# EAGLE design project (EAGLE 9.1.3)

## Sheet 1 of 2: Power supply denoising
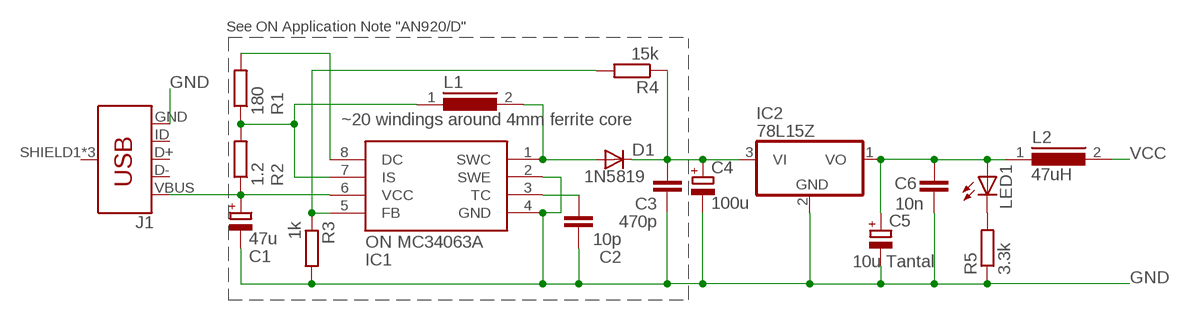
[diagram p0: schematic, sheet 1]

### Parts
C1  47u  CPOL-EUE2.5-5  [E2,5-5]
C2  10p  C-EU050-024X044  [C050-024X044]
C3  470p  C-EU050-024X044  [C050-024X044]
C4  100u  CPOL-EUE2.5-5  [E2,5-5]
C5  10u Tantal  CPOL-EUE2-4  [E2-4]
C6  10n  C-EU050-024X044  [C050-024X044]
D1  1N5819  1N4004  [DO41-10]
IC1  ON MC34063A  MC34063AP  [DIL08]
IC2  78L15Z  [TO92]
J1  USB_MICRO-B_FEMALE-SMT  [USB-B-MICRO-SMD]
L1  ~20 windings around 4mm ferrite core  82114R  [82114R]
L2  47uH  MCC10  [MCC10]
LED1  LED5MM  [LED5MM]
R1  180  R-EU_0207/7  [0207/7]
R2  1.2  R-EU_0207/7  [0207/7]
R3  1k  R-EU_0207/7  [0207/7]
R4  15k  R-EU_0207/7  [0207/7]
R5  3.3k  R-EU_0207/7  [0207/7]

### Nets
GND: C1.- C2.1 C3.1 C4.- C5.- C6.1 IC1.2(SWE) IC1.4(GND) IC2.2(GND) R3.2 R5.1 ; also sheet 2
N$7: IC1.8(DC) R1.2
N$11: D1.A IC1.1(SWC) L1.2
N$22: C5.+ C6.2 IC2.1(VO) L2.1 LED1.A
N$23: C3.2 C4.+ D1.C IC2.3(VI) R4.1
N$25: LED1.K(C) R5.2
N$26: C2.2 IC1.3(TC)
N$28: IC1.5(FB) R3.1 R4.2
N$29: C1.+ IC1.6(VCC) J1.VBUS R2.1
N$30: J1.GND
N$31: IC1.7(IS) L1.1 R1.1 R2.2
VCC: L2.2 ; also sheet 2
Unconnected: J1.D+ J1.D- J1.ID J1.SHIELD1(SHIELD) J1.SHIELD2(SHIELD) J1.SHIELD3(SHIELD)

### Notes on the sheet
- See ON Application Note "AN920/D"

## Sheet 2 of 2: Connectors and op-amp stages
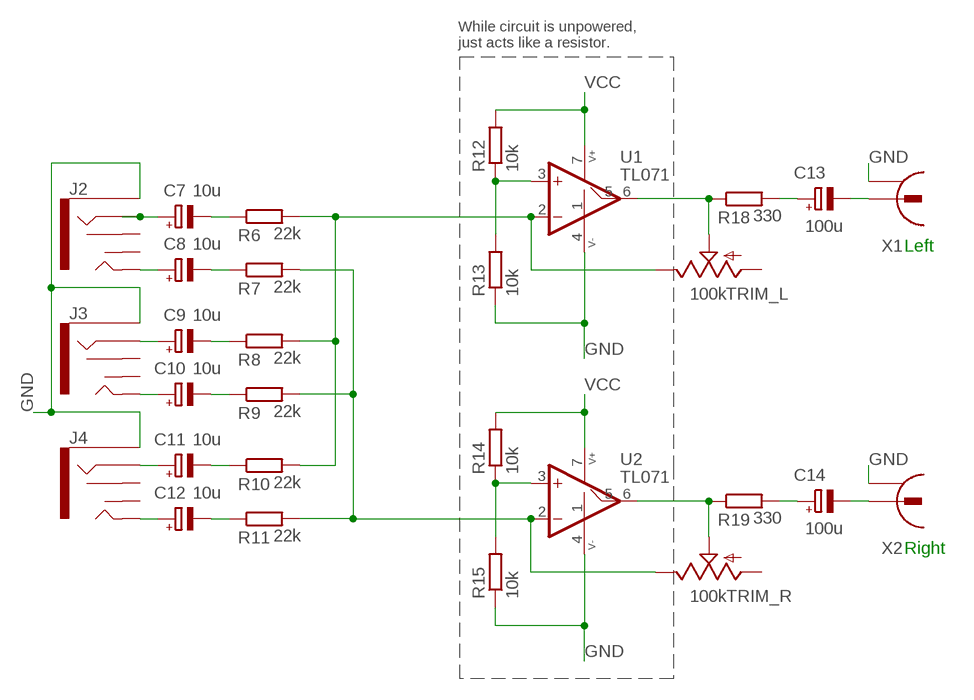
[diagram p1: schematic, sheet 2]

### Parts
C7  10u  CPOL-EUE2-4  [E2-4]
C8  10u  CPOL-EUE2-4  [E2-4]
C9  10u  CPOL-EUE2-4  [E2-4]
C10  10u  CPOL-EUE2-4  [E2-4]
C11  10u  CPOL-EUE2-4  [E2-4]
C12  10u  CPOL-EUE2-4  [E2-4]
C13  100u  CPOL-EUE2-4  [E2-4]
C14  100u  CPOL-EUE2-4  [E2-4]
J2  AUDIO_JACK_3.5MM_KIT  [AUDIO-JACK-KIT]
J3  AUDIO_JACK_3.5MM_KIT  [AUDIO-JACK-KIT]
J4  AUDIO_JACK_3.5MM_KIT  [AUDIO-JACK-KIT]
R6  22k  R-EU_0204/5  [0204/5]
R7  22k  R-EU_0204/5  [0204/5]
R8  22k  R-EU_0204/5  [0204/5]
R9  22k  R-EU_0204/5  [0204/5]
R10  22k  R-EU_0204/5  [0204/5]
R11  22k  R-EU_0204/5  [0204/5]
R12  10k  R-EU_0204/5  [0204/5]
R13  10k  R-EU_0204/5  [0204/5]
R14  10k  R-EU_0204/5  [0204/5]
R15  10k  R-EU_0204/5  [0204/5]
R18  330  R-EU_0204/5  [0204/5]
R19  330  R-EU_0204/5  [0204/5]
TRIM_L  100k  TRIM_US-B25P  [B25P]
TRIM_R  100k  TRIM_US-B25P  [B25P]
U1  TL071  TL081N  [DIL08]
U2  TL071  TL081N  [DIL08]
X1  CONRAD_736880-49  [CINCH]
X2  CONRAD_736880-49  [CINCH]

### Nets
GND: J2.SLEEVE J3.SLEEVE J4.SLEEVE R13.1 R15.1 U1.4(P:V-) U2.4(P:V-) X1.2 X2.2 ; also sheet 1
N$1: C13.- X1.1
N$2: C13.+ R18.2
N$3: C14.- X2.1
N$4: C7.- R6.1
N$5: R18.1 TRIM_L.S U1.6(A:OUT)
N$6: C14.+ R19.2
N$8: C7.+ J2.RING
N$9: R12.1 R13.2 U1.3(A:+IN)
N$10: C8.+ J2.TIP
N$12: R6.2 R8.2 R10.2 TRIM_L.E U1.2(A:-IN)
N$13: C8.- R7.1
N$14: C9.+ J3.RING
N$15: C9.- R8.1
N$16: C10.+ J3.TIP
N$17: C10.- R9.1
N$18: C11.+ J4.RING
N$19: C11.- R10.1
N$20: C12.+ J4.TIP
N$21: C12.- R11.1
N$24: R19.1 TRIM_R.S U2.6(A:OUT)
N$27: R14.1 R15.2 U2.3(A:+IN)
N$33: R7.2 R9.2 R11.2 TRIM_R.E U2.2(A:-IN)
VCC: R12.2 R14.2 U1.7(P:V+) U2.7(P:V+) ; also sheet 1
Unconnected: J2.RSH J2.TSH J3.RSH J3.TSH J4.RSH J4.TSH TRIM_L.A TRIM_R.A U1.1(-NULL:NULL1) U1.5(-NULL:NULL2) U2.1(-NULL:NULL1) U2.5(-NULL:NULL2) X1.2@2 X2.2@2

### Notes on the sheet
- While circuit is unpowered,
  just acts like a resistor.
- Left
- Right

## Library data of the parts
C1 C4 C5 C7-C14 = resistor:CPOL-EU: POLARIZED CAPACITOR, European symbol
C2 C3 C6 = resistor:C-EU: CAPACITOR, European symbol
D1 = diode:1N4004: DIODE general purpose rectifier, 1 A
IC1 = mc34063:MC34063
IC2 = linear:78*: Positive VOLTAGE REGULATOR Source: http://cache.national.com/ds/LM/LM78L05.pdf http://www.fairchildsemi.com/ds/LM/LM7805.pdf
J1 = SparkFun-Connectors:USB_MICRO-B: USB Type Micro-B Connector Male/female and PTH/SMT variants SparkFun Products: SparkFun microB USB Breakout <https://www.sparkfun.com/products/12035> SparkFun USB microB Plug Breakout <https://www.sparkfun.com/products/10031> SparkFun ESP8266 Thing <https://www.sparkfun.com/products/13231>; PROD_ID: CONN-11752
J2-J4 = SparkFun-Connectors:AUDIO_JACK_3.5MM: Audio Jack 3.5mm variants of PTH and SMT stereo audio jack with bypass switches. SparkFun Products: SparkFun SparkPunk Sound Kit <[https://www.sparkfun.com/products/11177]> - PTH MP3 Trigger <https://www.sparkfun.com/products/13720> -3.5mm SMD SparkFun PicoBoard <https://www.sparkfun.com/products/11888>- 2.5mm SMD; PROD_ID: CONN-08774; SF_ID: PRT-08032
L1 = inductors:82114R: INDUCTOR; SPICEPREFIX: L
L2 = inductors:MCC10: INDUCTOR; SPICEPREFIX: L
LED1 = led:LED: LED OSRAM: - CHIPLED LG R971, LG N971, LY N971, LG Q971, LY Q971, LO R971, LY R971 LH N974, LH R974 LS Q976, LO Q976, LY Q976 LO Q996 - Hyper CHIPLED LW Q18S LB Q993, LB Q99A, LB R99A - SideLED LS A670, LO A670, LY A670, LG A670, LP A670 LB A673, LV A673, LT A673, LW A673 LH A674 LY A675 LS A676, LA A676, LO A676, LY A676, LW A676 LS A679, LY A679, LG A679 - Hyper Micro SIDELED® LS Y876, LA Y876, LO Y876, LY Y876 LT Y87S - SmartLED LW L88C, LW L88S LB L89C, LB L89S, LG L890 LS L89K, LO L89K, LY L89K LS L896, LA L896, LO L896, LY L896 - TOPLED LS T670, LO T670, LY T670, LG T670, LP T670 LSG T670, LSP T670, LSY T670, LOP T670, LYG T670 LG T671, LOG T671, LSG T671 LB T673, LV T673, LT T673, LW T673 LH T674 LS T676, LA T676, LO T676, LY T676, LB T676, LH T676, LSB T676, LW T676 LB T67C, LV T67C, LT T67C, LS T67K, LO T67K, LY T67K, LW E67C LS E67B, LA E67B, LO E67B, LY E67B, LB E67C, LV E67C, LT E67C LW T67C LS T679, LY T679, LG T679 LS T770, LO T770, LY T770, LG T770, LP T770 LB T773, LV T773, LT T773, LW T773 LH T774 LS E675, LA E675, LY E675, LS T675 LS T776, LA T776, LO T776, LY T776, LB T776 LHGB T686 LT T68C, LB T68C - Hyper Mini TOPLED® LB M676 - Mini TOPLED Santana® LG M470 LS M47K, LO M47K, LY M47K Source: http://www.osram.convergy.de LUXEON: - LUMILED® LXK2-PW12-R00, LXK2-PW12-S00, LXK2-PW14-U00, LXK2-PW14-V00 LXK2-PM12-R00, LXK2-PM12-S00, LXK2-PM14-U00 LXK2-PE12-Q00, LXK2-PE12-R00, LXK2-PE12-S00, LXK2-PE14-T00, LXK2-PE14-U00 LXK2-PB12-K00, LXK2-PB12-L00, LXK2-PB12-M00, LXK2-PB14-N00, LXK2-PB14-P00, LXK2-PB14-Q00 LXK2-PR12-L00, LXK2-PR12-M00, LXK2-PR14-Q00, LXK2-PR14-R00 LXK2-PD12-Q00, LXK2-PD12-R00, LXK2-PD12-S00 LXK2-PH12-R00, LXK2-PH12-S00 LXK2-PL12-P00, LXK2-PL12-Q00, LXK2-PL12-R00 Source: www.luxeon.com KINGBRIGHT: KA-3528ASYC Source: www.kingbright.com
R1-R15 R18 R19 = resistor:R-EU_: RESISTOR, European symbol
TRIM_L TRIM_R = pot:TRIM_US-: POTENTIOMETER
U1 U2 = op-amp:TL081: JFET OP-AMP
X1 X2 = JRS:CONRAD_736880-49: Cinch Connector ( RCA Jack )

## Board
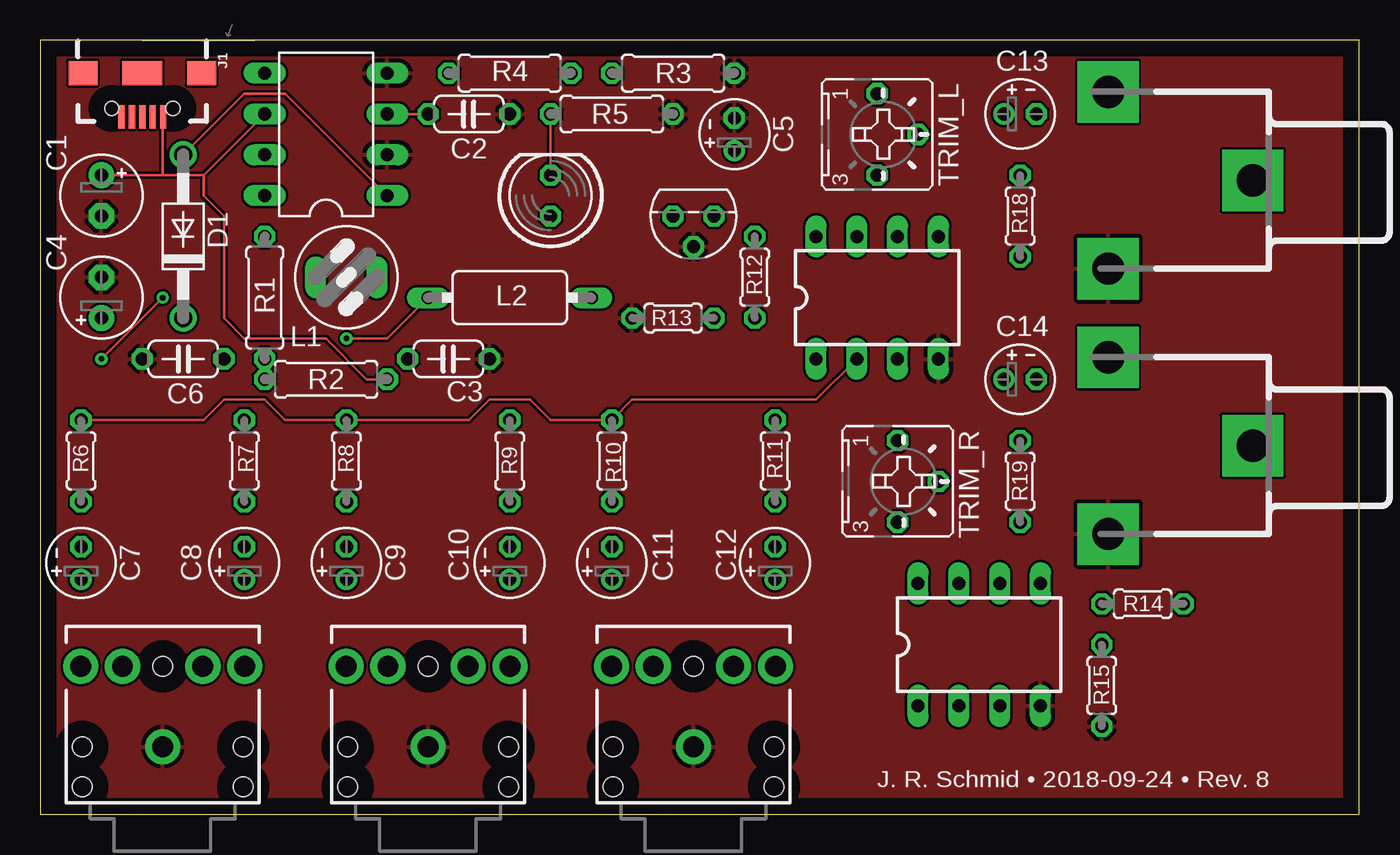
[diagram p2: board, top side]
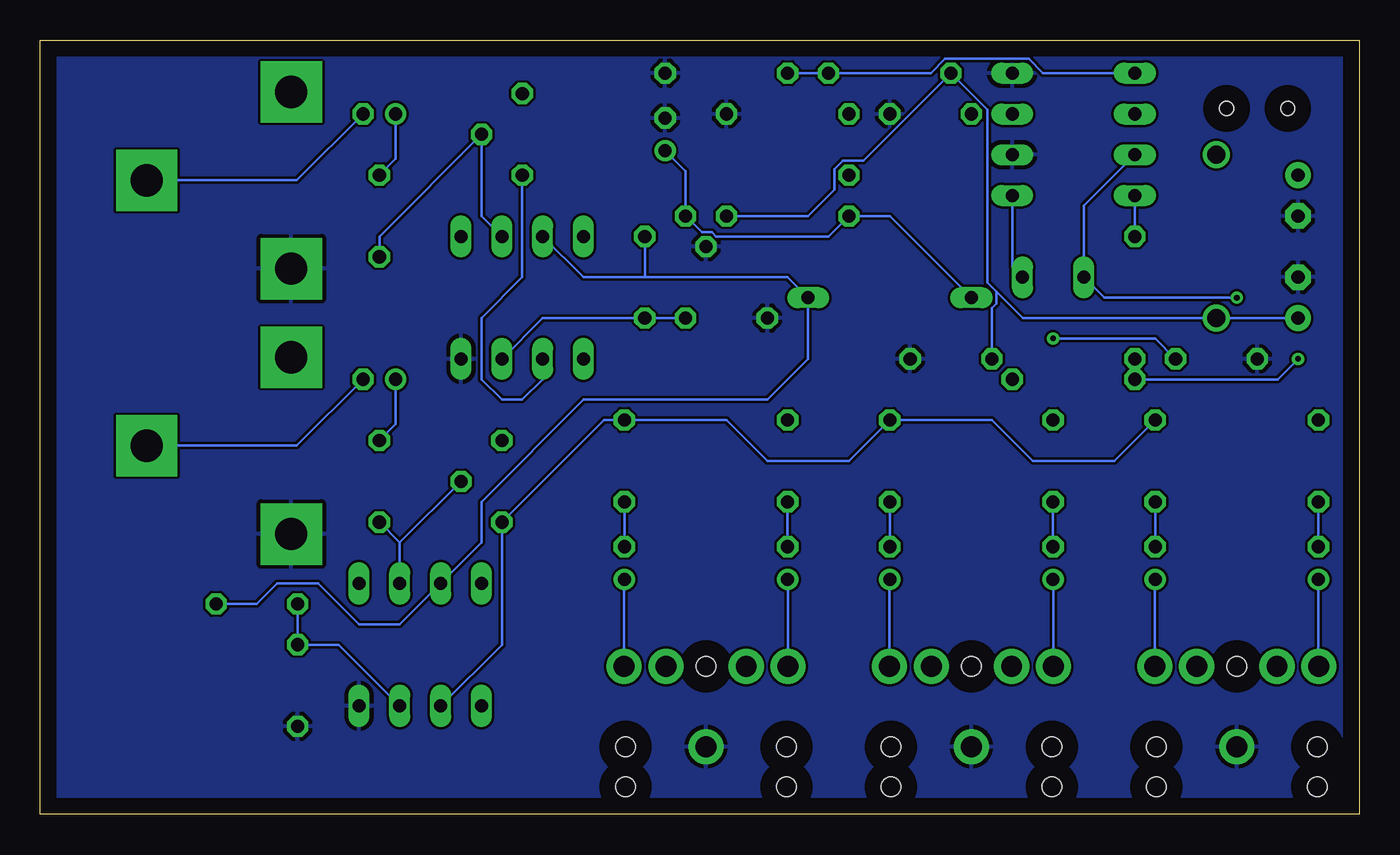
[diagram p3: board, bottom side, seen from below]

Size 82.06 x 48.17 mm. Coordinates in mm from the lower left corner, seen from the top.
Outline: 0,0 82.06,0 82.06,48.17 0,48.17 0,0
Copper layers (1*16): Top 0.035mm / dielectric 1.5mm / Bottom 0.035mm
Design rules "default": minimum track width 6mil, minimum drill 0.35mm, track to track 6mil, track to pad 6mil, pad to pad 6mil, via to via 6mil, smd to smd 6mil, copper to edge 40mil, drill to drill 6mil, minimum pad ring 10mil, minimum via ring 8mil, stop-mask expansion 4mil, vias tented up to drill 0mil, thermal gap 10mil

### Footprints (pad centres in the part's own frame; a part is rotated, then mirrored left to right if it is on the bottom)
E2,5-5 = drill 0.813 pad 1.6: + -1.27,0 | drill 0.813 pad 1.6 octagon: - 1.27,0
C050-024X044 = drill 0.813 octagon: 1 -2.54,0; 2 2.54,0
E2-4 = drill 0.813 pad 1.27: + -1.016,0 | drill 0.813 pad 1.27 octagon: - 1.016,0
DO41-10 = drill 1.118: A 5.08,0; C -5.08,0
DIL08 = drill 0.813 long: 1 -3.81,-3.81; 2 -1.27,-3.81; 3 1.27,-3.81; 4 3.81,-3.81; 5 3.81,3.81; 6 1.27,3.81; 7 -1.27,3.81; 8 -3.81,3.81
TO92 = drill 0.813 octagon: 1 -1.27,0; 2 0,1.905; 3 1.27,0
USB-B-MICRO-SMD = smd 1.45 x 0.4: D+ 2.725,0; D- 2.725,0.65; GND 2.725,-1.3; ID 2.725,-0.65; VBUS 2.725,1.3 | smd 1.5 x 1.8: SHIELD1 0,3.685; SHIELD2 0,-3.685 | smd 1.5 x 2.5: SHIELD3 0,0 | hole 0.85: 2.2,1.9; 2.2,-1.9
AUDIO-JACK-KIT = drill 1.3 pad 2.184: RING 5,5.1; RSH 5,2.5; SLEEVE 0,0; TIP 5,-5.1; TSH 5,-2.5 | hole 1.2: 0,5; -2.5,5; -2.5,-5; 0,-5; 5,0
82114R = drill 0.813 long: 1 0,1.905; 2 0,-1.905
MCC10 = drill 0.813 long: 1 -5.08,0; 2 5.08,0
LED5MM = drill 0.813 octagon: A -1.27,0; K 1.27,0
0207/7 = drill 0.813 octagon: 1 -3.81,0; 2 3.81,0
0204/5 = drill 0.813 octagon: 1 -2.54,0; 2 2.54,0
B25P = drill 0.813 octagon: A -2.54,0; E 2.54,0; S 0,2.54
CINCH = drill 2 pad 3.81 square: 1 -3.92,0; 2 5.08,5.5; 2@2 5.08,-5.5

### Placement (x,y rotation side)
C1  3.81,38.5 270 top
C2  26.67,43.58 180 top
C3  25.4,28.34 180 top
C4  3.81,32.15 90 top
C5  43.18,42.31 90 top
C6  8.89,28.34 0 top
C7  2.54,15.64 90 top
C8  12.7,15.64 90 top
C9  19.05,15.64 90 top
C10  29.21,15.64 90 top
C11  35.56,15.64 90 top
C12  45.72,15.64 90 top
C13  60.96,43.58 0 top
C14  60.96,27.07 0 top
D1  8.89,35.96 90 top
IC1  17.78,42.31 90 top
IC2  40.64,37.23 180 top
J1  6.35,46.12 270 top
J2  7.62,4.21 90 top
J3  24.13,4.21 90 top
J4  40.64,4.21 90 top
L1  19.05,33.42 90 top
L2  29.21,32.15 0 top
LED1  31.75,38.5 90 top
R1  13.97,32.15 90 top
R2  17.78,27.07 180 top
R3  39.37,46.12 0 top
R4  29.21,46.12 0 top
R5  35.56,43.58 180 top
R6  2.54,21.99 90 top
R7  12.7,21.99 90 top
R8  19.05,21.99 90 top
R9  29.21,21.99 90 top
R10  35.56,21.99 90 top
R11  45.72,21.99 90 top
R12  44.45,33.42 90 top
R13  39.37,30.88 0 top
R14  68.58,13.1 0 top
R15  66.04,8.02 90 top
R18  60.96,37.23 90 top
R19  60.96,20.72 90 top
TRIM_L  52.07,42.31 270 top
TRIM_R  53.34,20.72 270 top
U1  52.07,32.15 0 top
U2  58.42,10.56 0 top
X1  71.52,39.45 180 top
X2  71.52,22.94 180 top

### Tracks (layer width: path | path; a pad name or v marks a point on that pad's centre or on a via)
GND
  pour Top: -1.27,49.93 -1.27,-2.14 85.09,-2.14 85.09,51.2 -1.27,51.2
  pour Bottom: -1.27,51.2 -1.27,-2.14 85.09,-2.14 85.09,51.2
N$1
  Bottom 0.152: X1.1 71.12,39.45 66.11,39.45 C13.-
N$2
  Bottom 0.152: C13.+ 59.94,40.79 R18.2
N$3
  Bottom 0.152: X2.1 66.11,22.94 C14.-
N$4
  Bottom 0.152: C7.- R6.1
N$5
  Bottom 0.152: R18.1 60.96,35.96 TRIM_L.S 54.61,37.23 U1.6
N$6
  Bottom 0.152: C14.+ 59.94,24.28 R19.2
N$7
  Bottom 0.152: IC1.8 R1.2
N$8
  Bottom 0.152: J2.RING 2.54,9.23 C7.+
N$9
  Bottom 0.152: U1.3 50.8,30.88 R12.1 R13.2
N$10
  Bottom 0.152: J2.TIP 12.72,14.6 C8.+
N$11
  Top 0.152: D1.A 12.7,44.85 15.24,44.85 IC1.1
  Bottom 0.152: IC1.1 21.59,34.05 L1.2
N$12
  Top 0.152: U1.2 48.26,25.8 36.83,25.8 R10.2 31.75,24.53 30.48,25.8 27.94,25.8 26.67,24.53 R8.2 15.24,24.53 13.97,25.8 11.43,25.8 10.16,24.53 R6.2
  Bottom 0.152: TRIM_L.E 52.07,33.42 54.61,30.88 54.61,27.07 53.34,25.8 52.07,25.8 50.8,27.07 U1.2
N$13
  Bottom 0.152: C8.- R7.1
N$14
  Bottom 0.152: J3.RING 19.03,14.6 C9.+
N$15
  Bottom 0.152: C9.- R8.1
N$16
  Bottom 0.152: J3.TIP 29.23,14.6 C10.+
N$17
  Bottom 0.152: C10.- R9.1
N$18
  Bottom 0.152: J4.RING 35.54,14.6 C11.+
N$19
  Bottom 0.152: C11.- R10.1
N$20
  Bottom 0.152: J4.TIP 45.74,14.6 C12.+
N$21
  Bottom 0.152: C12.- R11.1
N$22  (via drill 0.35)
  Top 0.152: L2.1 21.59,29.61 v19.05,29.61
  Bottom 0.152: C5.+ 41.91,40.02 IC2.1 40.89,36.21 40.27,36.21 40.02,35.96 33.02,35.96 LED1.A 29.21,37.23 L2.1 | v19.05,29.61 12.7,29.61 C6.2
N$23
  Bottom 0.152: 22.58,32.52 22.58,31.78 22.86,31.5 C3.2 | 22.58,32.52 23.14,33.08 23.14,43.86 R4.1 30.86,40.66 32.12,40.66 32.64,40.14 32.64,38.88 34.29,37.23 IC2.3 | C4.+ D1.C 20.94,30.88 22.58,32.52
N$24
  Bottom 0.152: R19.1 59.69,16.91 | 59.69,16.91 U2.6 | TRIM_R.S 59.69,16.91
N$25
  Top 0.152: R5.2 LED1.K
N$26
  Top 0.152: IC1.3 C2.2
N$27
  Bottom 0.152: U2.3 63.5,10.56 R15.2 R14.1
N$28
  Bottom 0.152: R3.1 R4.2 26.66,46.12 25.77,47.01 20.56,47.01 19.67,46.12 IC1.5
N$29
  Top 0.152: IC1.6 10.16,39.77 | 10.16,39.77 7.62,39.77 | 7.62,39.77 C1.+ | J1.VBUS 7.62,43.36 7.62,39.77 | 10.16,39.77 | 10.16,39.77 10.16,38.5 11.43,37.23 11.43,30.88 12.7,29.61 17.78,29.61 20.32,27.07 R2.1
N$31  (via drill 0.35)
  Top 0.152: v7.62,32.15 v3.81,28.34
  Bottom 0.152: IC1.7 17.14,37.87 L1.1 15.88,32.15 v7.62,32.15 | v3.81,28.34 5.08,27.07 R2.2 R1.1
N$33
  Bottom 0.152: U2.2 53.34,10.56 TRIM_R.E 46.99,24.53 R11.2 39.37,24.53 36.83,21.99 31.75,21.99 R9.2 22.86,24.53 20.32,21.99 15.24,21.99 R7.2
VCC
  Bottom 0.152: R14.2 68.58,13.1 67.31,14.37 64.77,14.37 62.23,11.83 59.69,11.83 U2.7 54.61,16.91 54.61,19.45 48.26,25.8 36.83,25.8 34.29,28.34 L2.2 35.56,33.42 44.45,33.42 | U1.7 48.26,33.42 44.45,33.42 | R12.2 44.45,33.42

### Text on the board
tSilk: J. R. Schmid • 2018-09-24 • Rev. 8